# Altium schematic sheet info.SchDoc: Info
size A4; DocumentNumber: 1; SheetNumber: 1; SheetTotal: 8
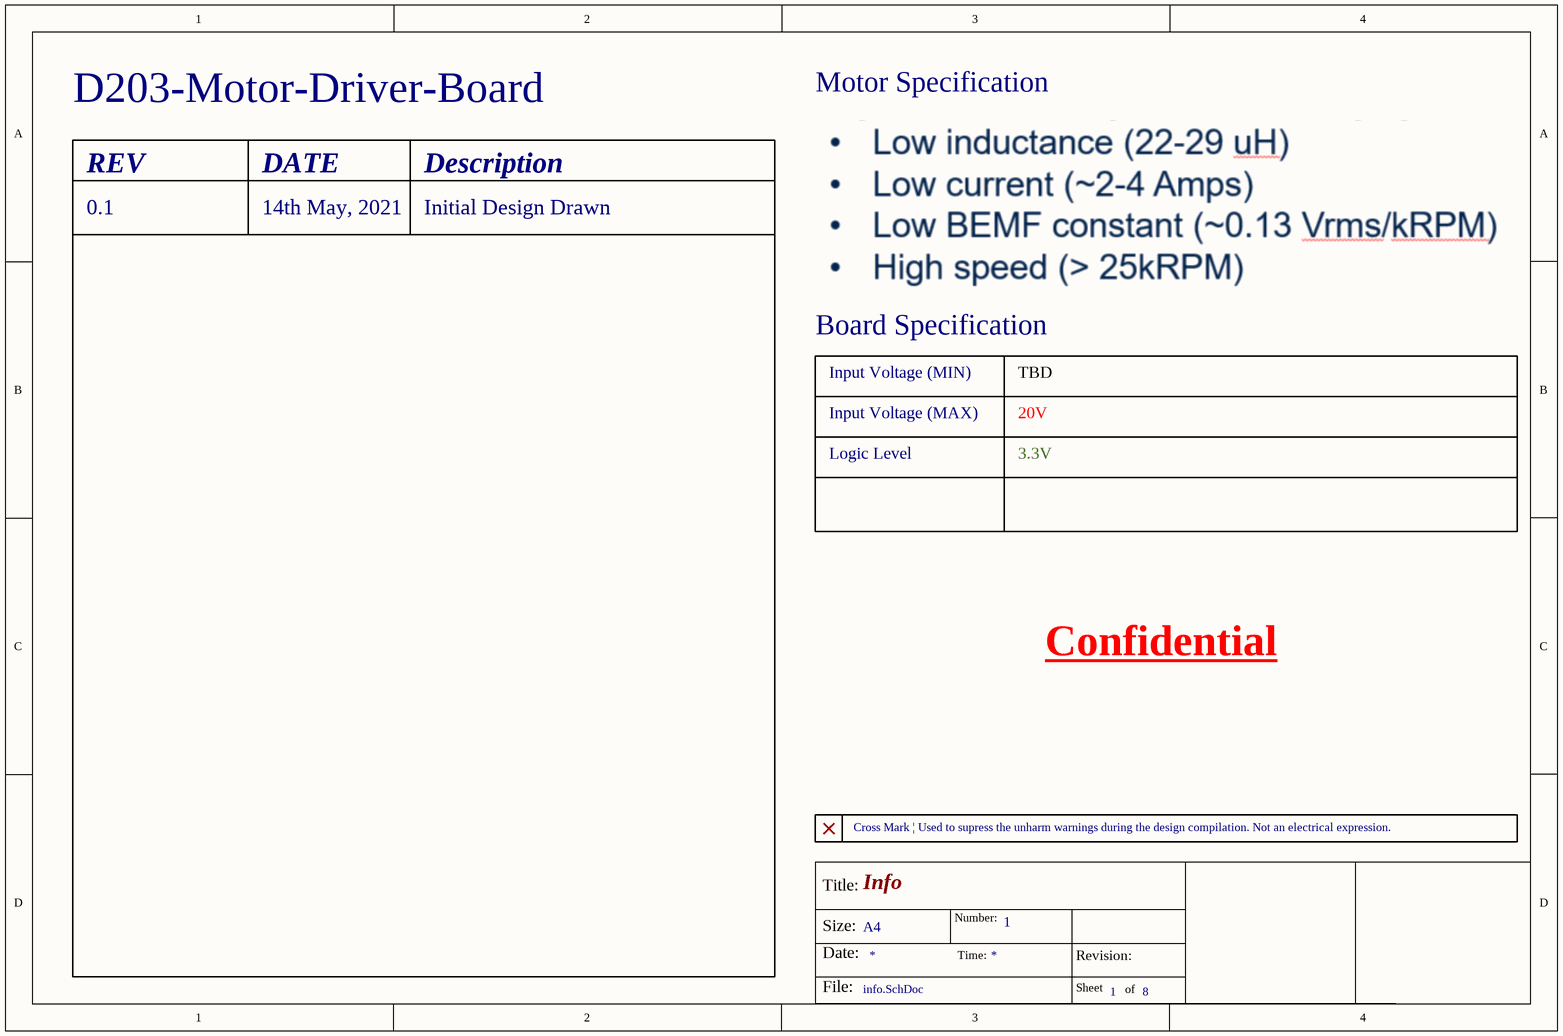
[diagram p0: info.SchDoc]

## Notes on the sheet
- D203-Motor-Driver-Board
- Motor Specification
- REV
- DATE
- Description
- 0.1
- 14th May, 2021
- Initial Design Drawn
- Board Specification
- Input Voltage (MIN)
- TBD
- Input Voltage (MAX)
- 20V
- Logic Level
- 3.3V
- Confidential
- Cross Mark | Used to supress the unharm warnings during the design compilation. Not an electrical expression.
- Title:
- Number:
- Size:
- Date:
- A4
- Time:
- Revision:
- Sheet
- File:
- of